# Altium schematic sheet Sheet1.SchDoc
size A; SheetNumber: 1; SheetTotal: 1
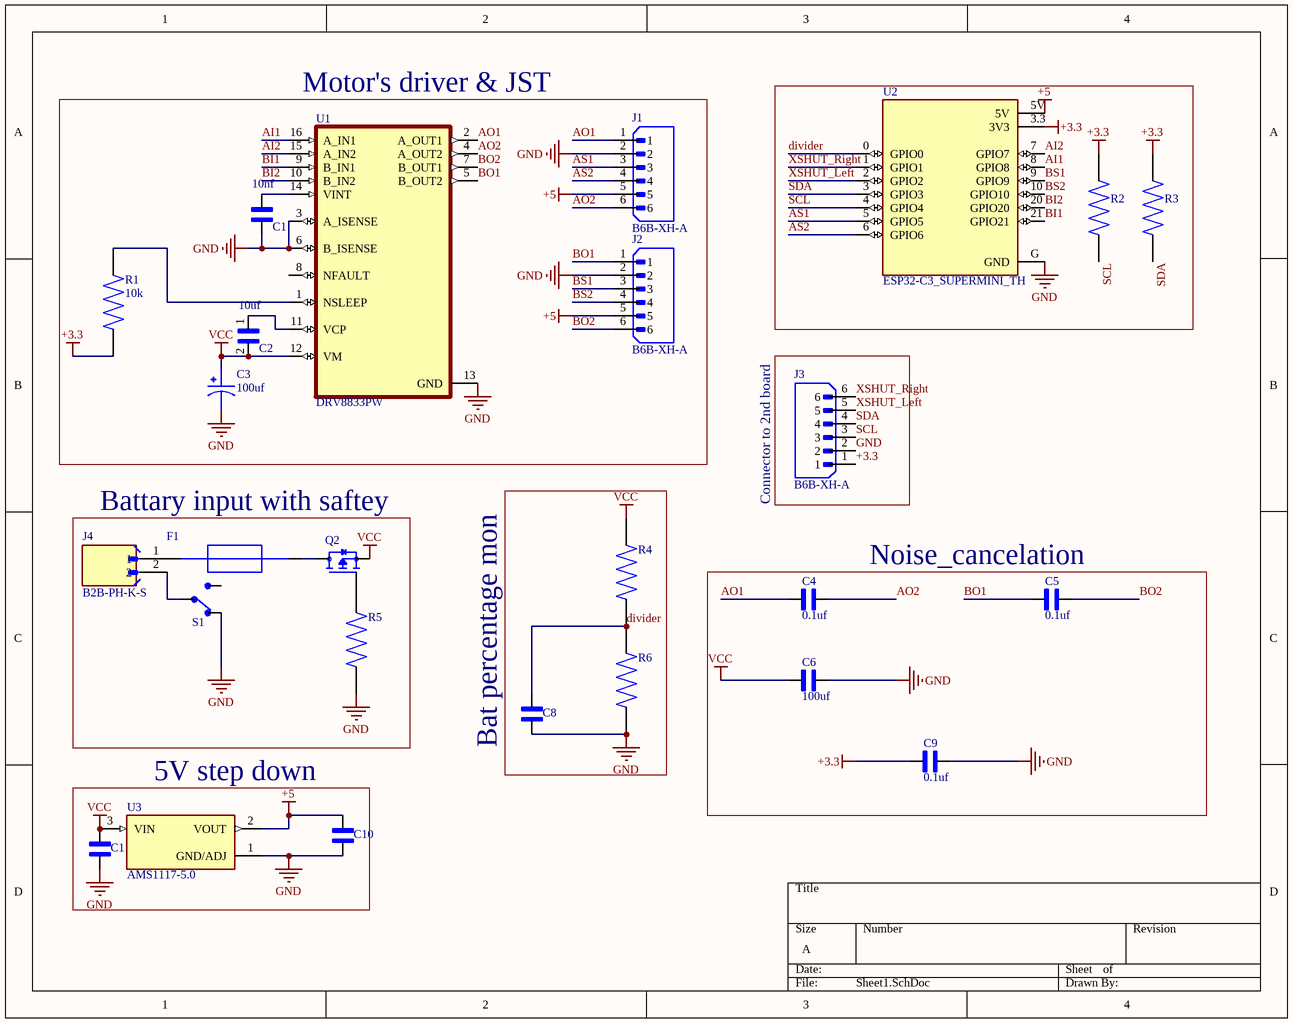
[diagram p0: Sheet1.SchDoc]

## Parts
C1  10nf  [CAPC2012X88N]
C2  10uf  [CAPC3216X180N]
C3  100uf  [CAPMP3216X180N]
C4  0.1uf  [CAP_ECHU1H181GX5]
C5  0.1uf  [CAP_ECHU1H181GX5]
C6  100uf  [CAPC3225X280N]
C8  C0805C473K1RACTU  [CAPC2012X88N]  (value not drawn)
C9  0.1uf  [CAPC3225X280N]
C10  C0805C473K1RACTU  [CAPC2012X88N]  (value not drawn)
C11  C0805C473K1RACTU  [CAPC2012X88N]  (value not drawn)
F1  1206L035YR  [FUSC3216X75N]  (value not drawn)
J1  B6B-XH-A  [JST_B6B-XH-A]
J2  B6B-XH-A  [JST_B6B-XH-A]
J3  B6B-XH-A  [JST_B6B-XH-A]
J4  B2B-PH-K-S  [JST_B2B-PH-K-S]
Q2  IRF9540  [TO254P1052X465X1989-3]  (value not drawn)
R1  10k  [RESC2012X60N]
R2  RC0805JR-0739RL  [RESC2012X60N]  (value not drawn)
R3  RC0805JR-0739RL  [RESC2012X60N]  (value not drawn)
R4  RC0805JR-0739RL  [RESC2012X60N]  (value not drawn)
R5  RC0805JR-0739RL  [RESC2012X60N]  (value not drawn)
R6  RC0805JR-0739RL  [RESC2012X60N]  (value not drawn)
S1  1101M2S3CQE2  [SW_1101M2S3CQE2]  (value not drawn)
U1  DRV8833PW  [SOP65P640X120-16N]
U2  ESP32-C3_SUPERMINI_TH  [MODULE_ESP32-C3_SUPERMINI_TH]
U3  AMS1117-5.0  [SOT229P700X180-4N]

## Blocks framed on the sheet
Motor's driver & JST: C1-C3 J1 J2 R1 U1
Connector to 2nd board: J3
Bat percentage mon: C8 R4 R6
Battary input with saftey: F1 J4 Q2 R5 S1
Noise_cancelation: C4-C6 C9
5V step down: C10 C11 U3

## Nets
+3.3: C9.1 J3.1 R1.1 R2.1 R3.1 U2.3.3(3V3)
+5: C10.1 J1.5 J2.5 U2.5V U3.2(VOUT)
GND: C1.2 C3.2 C6.2 C8.2 C9.2 C10.2 C11.1 J1.2 J2.2 J3.2 R5.1 R6.1 S1.1 U1.3(A_ISENSE) U1.6(B_ISENSE) U1.13(GND) U2.G(GND) U3.1(GND/ADJ)
VCC: C2.2 C3.1 C6.1 C11.2 Q2.3(S) R4.2 U1.12(VM) U3.3(VIN)
AI1: U1.16(A_IN1) U2.8(GPIO8)
AI2: U1.15(A_IN2) U2.7(GPIO7)
AO1: C4.2 J1.1 U1.2(A_OUT1)
AO2: C4.1 J1.6 U1.4(A_OUT2)
AS1: J1.3 U2.5(GPIO5)
AS2: J1.4 U2.6(GPIO6)
BI1: U1.9(B_IN1) U2.21(GPIO21)
BI2: U1.10(B_IN2) U2.20(GPIO20)
BO1: C5.2 J2.1 U1.5(B_OUT2)
BO2: C5.1 J2.6 U1.7(B_OUT1)
BS1: J2.3 U2.9(GPIO9)
BS2: J2.4 U2.10(GPIO10)
divider: C8.1 R4.1 R6.2 U2.0(GPIO0)
SCL: J3.3 R2.2 U2.4(GPIO4)
SDA: J3.4 R3.2 U2.3(GPIO3)
XSHUT_Left: J3.5 U2.2(GPIO2)
XSHUT_Right: J3.6 U2.1(GPIO1)
NetC1_1: C1.1 U1.14(VINT)
NetC2_1: C2.1 U1.11(VCP)
NetF1_1: F1.1 J4.1
NetF1_2: F1.2 Q2.2(D)
NetJ4_2: J4.2 S1.2
NetQ2_1: Q2.1(G) R5.2
NetR1_2: R1.2 U1.1(NSLEEP)

Not connected (* = marked no-connect by the designer): S1 3; U1 8(NFAULT)

## Library data of the parts
C1 C8 C10 C11 = C0805C473K1RACTU: 0805 X7R ceramic capacitor,47nF 100V | KEMET C0805C473K1RACTU; SnapEDA_Link: https://www.snapeda.com/parts/C0805C473K1RACTU/KEMET/view-part/?ref=snap; Package: 805-2 KEMET; Value: *; MF: KEMET; MP: C0805C473K1RACTU; Check_prices: https://www.snapeda.com/parts/C0805C473K1RACTU/KEMET/view-part/?ref=eda
C2 = C3216NP02J103J160AA: C Series 1206 10 nF 630 V Â±5 % Tolerance NP0 SMT Multilayer Ceramic Capacitor; MF: TDK; Package: 3216 TDK; Value: *; Purchase-URL: https://pricing.snapeda.com/search/part/C3216NP02J103J160AA/?ref=eda; Availability: In Stock; MP: C3216NP02J103J160AA; Check_prices: https://www.snapeda.com/parts/C3216NP02J103J160AA/TDK/view-part/?ref=eda; SnapEDA_Link: https://www.snapeda.com/parts/C3216NP02J103J160AA/TDK/view-part/?ref=snap; Price: None
C3 = TAJA106M010RNJ: Capacitor;Tantalum;Cap 10uF;Tol 20%;SMT;Vol-Rtg 10V;Code 3216;TR | AVX TAJA106M010RNJ; SnapEDA_Link: https://www.snapeda.com/parts/TAJA106M010RNJ/AVX/view-part/?ref=snap; Package: 1206 AVX; Value: *; MF: AVX; MP: TAJA106M010RNJ; Check_prices: https://www.snapeda.com/parts/TAJA106M010RNJ/AVX/view-part/?ref=eda
C4 C5 = ECHU1H181GX5: Capacitor Pps Film, 180pf, 50v, 2%, 0805capacitor Pps Film, 180pf, 50v, 2%, 0805; MF: Panasonic; Digi-Key_Part_Number: PCF1287TR-ND; SnapEDA_Link: https://www.snapeda.com/parts/ECHU1H181GX5/Panasonic/view-part/?ref=snap; Check_prices: https://www.snapeda.com/parts/ECHU1H181GX5/Panasonic/view-part/?ref=eda; Package: 0805-2 Panasonic; Purchase-URL: https://pricing.snapeda.com/search/part/ECHU1H181GX5/?ref=eda; MP: ECHU1H181GX5; Value: *
C6 C9 = CL32A107MQVNNWE: 100 ÂµF Â±20% 6.3V Ceramic Capacitor X5R 1210 (3225 Metric); MF: Samsung; SnapEDA_Link: https://www.snapeda.com/parts/CL32A107MQVNNWE/Samsung/view-part/?ref=snap; Package: SMD-2 Samsung; Value: *; MP: CL32A107MQVNNWE; Check_prices: https://www.snapeda.com/parts/CL32A107MQVNNWE/Samsung/view-part/?ref=eda
F1 = 1206L035YR: Polymeric PTC Resettable Fuse 6V 350 mA Ih Surface Mount 1206 (3216 Metric), Concave; MF: Littelfuse Inc.; SnapEDA_Link: https://www.snapeda.com/parts/1206L035YR/Littelfuse/view-part/?ref=snap; Package: 1206 Littelfuse; Value: *; MP: 1206L035YR; Check_prices: https://www.snapeda.com/parts/1206L035YR/Littelfuse/view-part/?ref=eda
J1-J3 = B6B-XH-A: MF: {'manufacturer': u'JST Sales America Inc.'}; Package: None; Price: None; Value: *; MP: B6B-XH-A; Availability: Unavailable
J4 = B2B-PH-K-S: Connector Header Through Hole 2 position 0.079 (2.00mm); MF: JST Sales America Inc.; SnapEDA_Link: https://www.snapeda.com/parts/B2B-PH-K-S/JST/view-part/?ref=snap; Package: None; Value: *; MP: B2B-PH-K-S; Check_prices: https://www.snapeda.com/parts/B2B-PH-K-S/JST/view-part/?ref=eda
Q2 = IRF9540: P-Channel 100 V 19A (Tc) 3.7W (Ta), 150W (Tc) Surface Mount DÂ²PAK (TO-263); MF: Vishay; SnapEDA_Link: https://www.snapeda.com/parts/IRF9540/Vishay+Siliconix/view-part/?ref=snap; Package: TO-220-3 Vishay; Value: *; MP: IRF9540; Check_prices: https://www.snapeda.com/parts/IRF9540/Vishay+Siliconix/view-part/?ref=eda
R1-R6 = RC0805JR-0739RL: Surface Mount Thick Film Resistor, RC Series, 39 ohm, 125 mW, - 5%, 150 V, 0805 [2012 Metric]; MF: Yageo; SnapEDA_Link: https://www.snapeda.com/parts/RC0805JR-0739RL/Yageo/view-part/?ref=snap; Package: 2012 Yageo; Value: *; MP: RC0805JR-0739RL; Check_prices: https://www.snapeda.com/parts/RC0805JR-0739RL/Yageo/view-part/?ref=eda
S1 = 1101M2S3CQE2: Switch,Slide,Sealed,SPDT,ON-NONE-ON,PC Mnt,.200 Blk Act,6A,120VAC,PC Thru-Hole | C&K 1101M2S3CQE2; SnapEDA_Link: https://www.snapeda.com/parts/1101M2S3CQE2/C%2526K/view-part/?ref=snap; Package: None; Value: *; MF: C&K; MP: 1101M2S3CQE2; Check_prices: https://www.snapeda.com/parts/1101M2S3CQE2/C%2526K/view-part/?ref=eda
U1 = DRV8833PW: 10.8-V, 2-A dual H-bridge motor driver with current regulation; MF: Texas Instruments; SnapEDA_Link: https://www.snapeda.com/parts/DRV8833PW/Texas+Instruments/view-part/?ref=snap; Package: TSSOP-16 Texas Instruments; Value: *; MP: DRV8833PW; Check_prices: https://www.snapeda.com/parts/DRV8833PW/Texas+Instruments/view-part/?ref=eda
U2 = ESP32-C3_SUPERMINI_TH: Super tiny ESP32-C3 board; MF: Espressif Systems; MP: ESP32-C3 SuperMini_TH; SnapEDA_Link: https://www.snapeda.com/parts/ESP32-C3%20SuperMini_TH/Espressif+Systems/view-part/?ref=snap; Package: Package; Value: *; Check_prices: https://www.snapeda.com/parts/ESP32-C3%20SuperMini_TH/Espressif+Systems/view-part/?ref=eda
U3 = AMS1117-5.0: 1A LOW DROPOUT VOLTAGE REGULATOR; MF: ams; MP: AMS1117-5.0; Package: SOT-223 Seeed Technology; SnapEDA_Link: https://www.snapeda.com/parts/AMS1117-5.0/ams/view-part/?ref=snap; Check_prices: https://www.snapeda.com/parts/AMS1117-5.0/ams/view-part/?ref=eda; Availability: Not in stock; Value: *; Price: None